# EAGLE design pic32 (EAGLE 9.3.0)
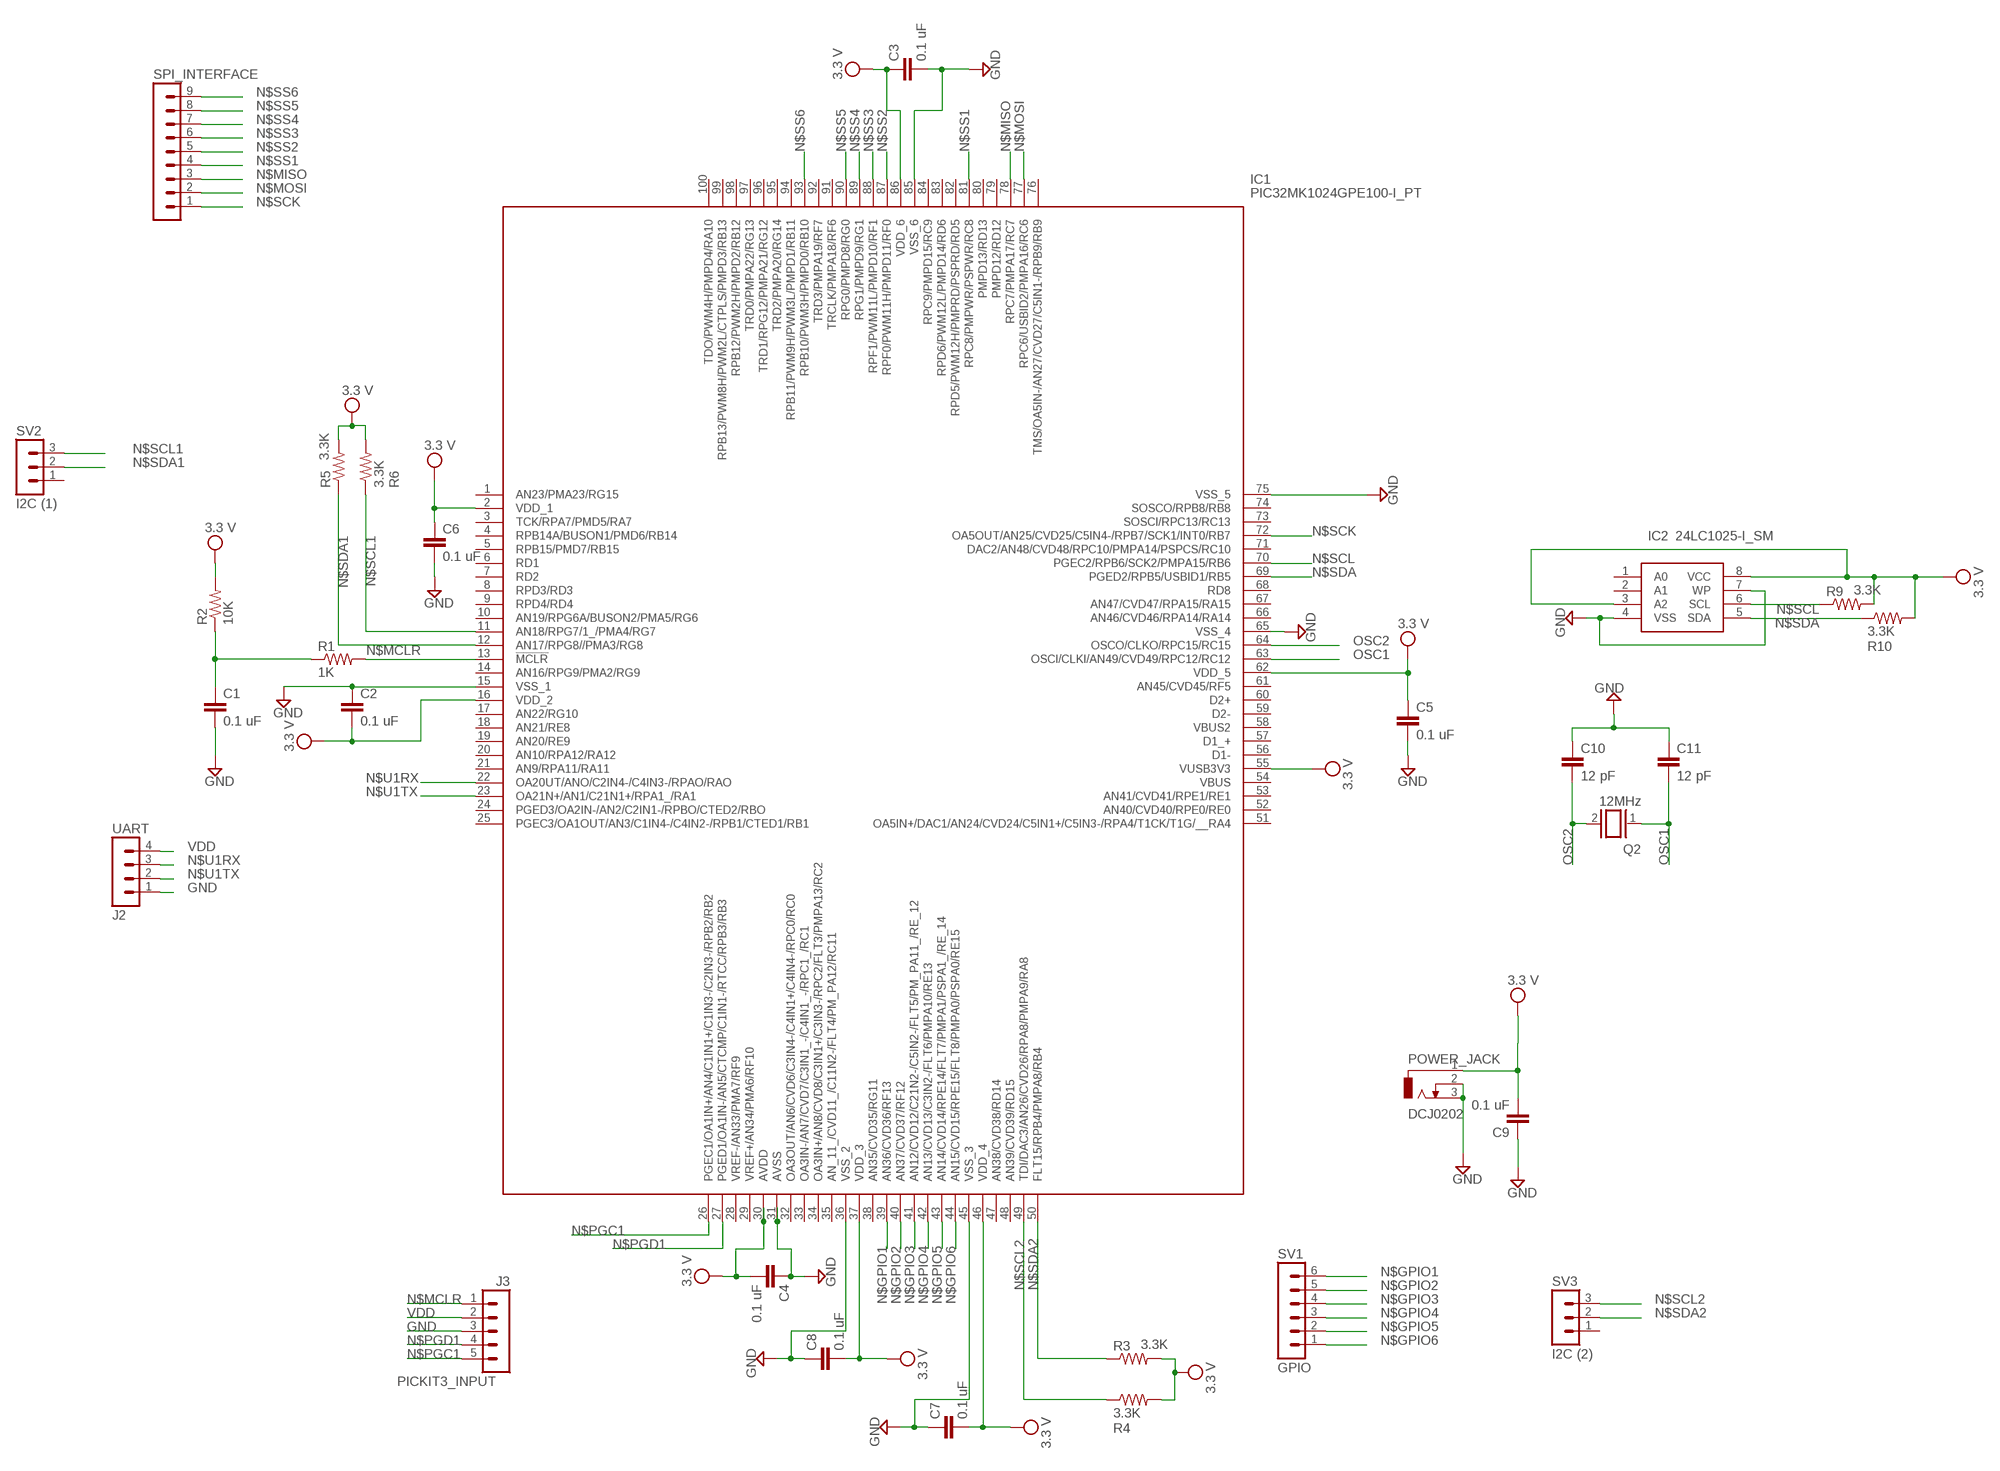
[diagram p0: schematic, sheet 1]

## Parts
C1  0.1 uF  C-EU025-025X050  [C025-025X050]
C2  0.1 uF  C-EU025-025X050  [C025-025X050]
C3  0.1 uF  C-EU025-025X050  [C025-025X050]
C4  0.1 uF  C-EU025-025X050  [C025-025X050]
C5  0.1 uF  C-EU025-025X050  [C025-025X050]
C6  0.1 uF  C-EU025-025X050  [C025-025X050]
C7  0.1 uF  C-EU025-025X050  [C025-025X050]
C8  0.1 uF  C-EU025-025X050  [C025-025X050]
C9  0.1 uF  C-EU025-025X050  [C025-025X050]
C10  12 pF  C-EU025-025X050  [C025-025X050]
C11  12 pF  C-EU025-025X050  [C025-025X050]
IC1  PIC32MK1024GPE100-I_PT  [QFP40P1400X1400X120-100N]
IC2  24LC1025-I_SM  [SOIC127P794X203-8N]
PICKIT3_INPUT  J3  MA05-1  [MA05-1]
POWER_JACK  DCJ0202  [DCJ0202]
Q2  12MHz  XTAL/S  [QS]
R1  1K  R-US_0207/7  [0207/7]
R2  10K  R-US_0207/7  [0207/7]
R3  3.3K  R-US_0207/7  [0207/7]
R4  3.3K  R-US_0207/7  [0207/7]
R5  3.3K  R-US_0207/7  [0207/7]
R6  3.3K  R-US_0207/7  [0207/7]
R9  3.3K  R-US_0207/7  [0207/7]
R10  3.3K  R-US_0207/7  [0207/7]
SPI_INTERFACE  J1  MA09-1  [MA09-1]
SV1  GPIO  MA06-1  [MA06-1]
SV2  I2C (1)  MA03-1  [MA03-1]
SV3  I2C (2)  MA03-1  [MA03-1]
UART  J2  MA04-1  [MA04-1]

## Nets
GND: C1.2 C2.1 C3.2 C4.1 C5.2 C6.2 C7.1 C8.1 C9.1 C10.1 C11.1 IC1.15(VSS_1) IC1.31(AVSS) IC1.36(VSS_2) IC1.45(VSS_3) IC1.65(VSS_4) IC1.75(VSS_5) IC1.85(VSS_6) IC2.4(VSS) IC2.7(WP) PICKIT3_INPUT.3 POWER_JACK.2 POWER_JACK.3 UART.1
N$1: C1.1 R1.1 R2.1
N$GPIO1: IC1.39(AN36/CVD36/RF13) SV1.6
N$GPIO2: IC1.40(AN37/CVD37/RF12) SV1.5
N$GPIO3: IC1.41(AN12/CVD12/C21N2-/C5IN2-/FLT5/PM_PA11_/RE_12) SV1.4
N$GPIO4: IC1.42(AN13/CVD13/C3IN2-/FLT6/PMPA10/RE13) SV1.3
N$GPIO5: IC1.43(AN14/CVD14/RPE14/FLT7/PMPA1/PSPA1_/RE_14) SV1.2
N$GPIO6: IC1.44(AN15/CVD15/RPE15/FLT8/PMPA0/PSPA0/RE15) SV1.1
N$MCLR: IC1.13(!MCLR) PICKIT3_INPUT.1 R1.2
N$MISO: IC1.78(RPC7/PMPA17/RC7) SPI_INTERFACE.3
N$MOSI: IC1.77(RPC6/USBID2/PMPA16/RC6) SPI_INTERFACE.2
N$PGC1: IC1.26(PGEC1/OA1IN+/AN4/C1IN1+/C1IN3-/C2IN3-/RPB2/RB2) PICKIT3_INPUT.5
N$PGD1: IC1.27(PGED1/OA1IN-/AN5/CTCMP/C1IN1-/RTCC/RPB3/RB3) PICKIT3_INPUT.4
N$SCK: IC1.72(OA5OUT/AN25/CVD25/C5IN4-/RPB7/SCK1/INT0/RB7) SPI_INTERFACE.1
N$SCL: IC1.70(PGEC2/RPB6/SCK2/PMPA15/RB6) IC2.6(SCL) R9.1
N$SCL1: IC1.11(AN18/RPG7/1_/PMA4/RG7) R6.1 SV2.3
N$SCL2: IC1.49(TDI/DAC3/AN26/CVD26/RPA8/PMPA9/RA8) R4.1 SV3.3
N$SDA: IC1.69(PGED2/RPB5/USBID1/RB5) IC2.5(SDA) R10.1
N$SDA1: IC1.12(AN17/RPG8//PMA3/RG8) R5.1 SV2.2
N$SDA2: IC1.50(FLT15/RPB4/PMPA8/RB4) R3.1 SV3.2
N$SS1: IC1.81(RPC8/PMPWR/PSPWR/RC8) SPI_INTERFACE.4
N$SS2: IC1.87(RPF0/PWM11H/PMPD11/RF0) SPI_INTERFACE.5
N$SS3: IC1.88(RPF1/PWM11L/PMPD10/RF1) SPI_INTERFACE.6
N$SS4: IC1.89(RPG1/PMPD9/RG1) SPI_INTERFACE.7
N$SS5: IC1.90(RPG0/PMPD8/RG0) SPI_INTERFACE.8
N$SS6: IC1.93(RPB10/PWM3H/PMPD0/RB10) SPI_INTERFACE.9
N$U1RX: IC1.22(OA20UT/ANO/C2IN4-/C4IN3-/RPAO/RAO) UART.3
N$U1TX: IC1.23(OA21N+/AN1/C21N1+/RPA1_/RA1) UART.2
OSC1: C11.2 IC1.63(OSCI/CLKI/AN49/CVD49/RPC12/RC12) Q2.1
OSC2: C10.2 IC1.64(OSCO/CLKO/RPC15/RC15) Q2.2
VDD: C2.2 C3.1 C4.2 C5.1 C6.1 C7.2 C8.2 C9.2 IC1.2(VDD_1) IC1.16(VDD_2) IC1.30(AVDD) IC1.37(VDD_3) IC1.46(VDD_4) IC1.55(VUSB3V3) IC1.62(VDD_5) IC1.86(VDD_6) IC2.3(A2) IC2.8(VCC) PICKIT3_INPUT.2 POWER_JACK.1 R2.2 R3.2 R4.2 R5.2 R6.2 R9.2 R10.2 UART.4 ; supply symbol labelled 3.3 V
Unconnected: IC1.1(AN23/PMA23/RG15) IC1.3(TCK/RPA7/PMD5/RA7) IC1.4(RPB14A/BUSON1/PMD6/RB14) IC1.5(RPB15/PMD7/RB15) IC1.6(RD1) IC1.7(RD2) IC1.8(RPD3/RD3) IC1.9(RPD4/RD4) IC1.10(AN19/RPG6A/BUSON2/PMA5/RG6) IC1.14(AN16/RPG9/PMA2/RG9) IC1.17(AN22/RG10) IC1.18(AN21/RE8) IC1.19(AN20/RE9) IC1.20(AN10/RPA12/RA12) IC1.21(AN9/RPA11/RA11) IC1.24(PGED3/OA2IN-/AN2/C2IN1-/RPBO/CTED2/RBO) IC1.25(PGEC3/OA1OUT/AN3/C1IN4-/C4IN2-/RPB1/CTED1/RB1) IC1.28(VREF-/AN33/PMA7/RF9) IC1.29(VREF+/AN34/PMA6/RF10) IC1.32(OA3OUT/AN6/CVD6/C3IN4-/C4IN1+/C4IN4-/RPC0/RC0) IC1.33(OA3IN-/AN7/CVD7/C3IN1_-/C4IN1_-/RPC1_/RC1) IC1.34(OA3IN+/AN8/CVD8/C3IN1+/C3IN3-/RPC2/FLT3/PMPA13/RC2) IC1.35(AN_11_/CVD11_/C11N2-/FLT4/PM_PA12/RC11) IC1.38(AN35/CVD35/RG11) IC1.47(AN38/CVD38/RD14) IC1.48(AN39/CVD39/RD15) IC1.51(OA5IN+/DAC1/AN24/CVD24/C5IN1+/C5IN3-/RPA4/T1CK/T1G/__RA4) IC1.52(AN40/CVD40/RPE0/RE0) IC1.53(AN41/CVD41/RPE1/RE1) IC1.54(VBUS) IC1.56(D1-) IC1.57(D1_+) IC1.58(VBUS2) IC1.59(D2-) IC1.60(D2+) IC1.61(AN45/CVD45/RF5) IC1.66(AN46/CVD46/RPA14/RA14) IC1.67(AN47/CVD47/RPA15/RA15) IC1.68(RD8) IC1.71(DAC2/AN48/CVD48/RPC10/PMPA14/PSPCS/RC10) IC1.73(SOSCI/RPC13/RC13) IC1.74(SOSCO/RPB8/RB8) IC1.76(TMS/OA5IN-/AN27/CVD27/C5IN1-/RPB9/RB9) IC1.79(PMPD12/RD12) IC1.80(PMPD13/RD13) IC1.82(RPD5/PWM12H/PMPRD/PSPRD/RD5) IC1.83(RPD6/PWM12L/PMPD14/RD6) IC1.84(RPC9/PMPD15/RC9) IC1.91(TRCLK/PMPA18/RF6) IC1.92(TRD3/PMPA19/RF7) IC1.94(RPB11/PWM9H/PWM3L/PMPD1/RB11) IC1.95(TRD2/PMPA20/RG14) IC1.96(TRD1/RPG12/PMPA21/RG12) IC1.97(TRD0/PMPA22/RG13) IC1.98(RPB12/PWM2H/PMPD2/RB12) IC1.99(RPB13/PWM8H/PWM2L/CTPLS/PMPD3/RB13) IC1.100(TDO/PWM4H/PMPD4/RA10) IC2.1(A0) IC2.2(A1) SV2.1 SV3.1

## Library data of the parts
C1-C11 = rcl:C-EU: CAPACITOR, European symbol; SPICEPREFIX: C
IC1 = SamacSys_Parts:PIC32MK1024GPE100-I_PT: 32-bit Microcontrollers - MCU MCU32, 120MHz, 4 I2C, 6 I2S, USB FS, CAN 2.0B, 12-bit ADC Source: Datasheet <https://componentsearchengine.com/Datasheets/1/PIC32MK1024GPE100-I_PT.pdf>; DESCRIPTION: 32-bit Microcontrollers - MCU MCU32, 120MHz, 4 I2C, 6 I2S, USB FS, CAN 2.0B, 12-bit ADC; HEIGHT: 1.2mm; MANUFACTURER_NAME: Microchip; MANUFACTURER_PART_NUMBER: PIC32MK1024GPE100-I/PT; MOUSER_PART_NUMBER: 579-2MK1024GPE100IPT; MOUSER_PRICE-STOCK: https://www.mouser.com/Search/Refine.aspx?Keyword=579-2MK1024GPE100IPT
IC2 = 24LC1025-I_SM:24LC1025-I_SM: 1M 128Kx8 2.5V Ser. EEPROM,24LC1025-I/SM Source: Datasheet <https://componentsearchengine.com/Datasheets/1/24LC1025-I_SM.pdf>; DESCRIPTION: 1M 128Kx8 2.5V Ser. EEPROM,24LC1025-I/SM; HEIGHT: 2.03mm; MANUFACTURER_NAME: Microchip; MANUFACTURER_PART_NUMBER: 24LC1025-I/SM; MOUSER_PART_NUMBER: 579-24LC1025-I/SM; MOUSER_PRICE-STOCK: https://www.mouser.com/Search/Refine.aspx?Keyword=579-24LC1025-I%2FSM
PICKIT3_INPUT = con-lstb:MA05-1: PIN HEADER; OC_FARNELL: unknown; OC_NEWARK: unknown
POWER_JACK = con-jack:DCJ0202: DC POWER JACK Source: DCJ0202.pdf; OC_FARNELL: unknown; OC_NEWARK: unknown
Q2 = special:XTAL/S: CRYSTAL
R1-R6 R9 R10 = rcl:R-US_: RESISTOR, American symbol; SPICEPREFIX: R
SPI_INTERFACE = con-lstb:MA09-1: PIN HEADER; OC_FARNELL: unknown; OC_NEWARK: unknown
SV1 = con-lstb:MA06-1: PIN HEADER; OC_FARNELL: unknown; OC_NEWARK: unknown
SV2 SV3 = con-lstb:MA03-1: PIN HEADER; OC_FARNELL: unknown; OC_NEWARK: unknown
UART = con-lstb:MA04-1: PIN HEADER; OC_FARNELL: unknown; OC_NEWARK: unknown

## Board
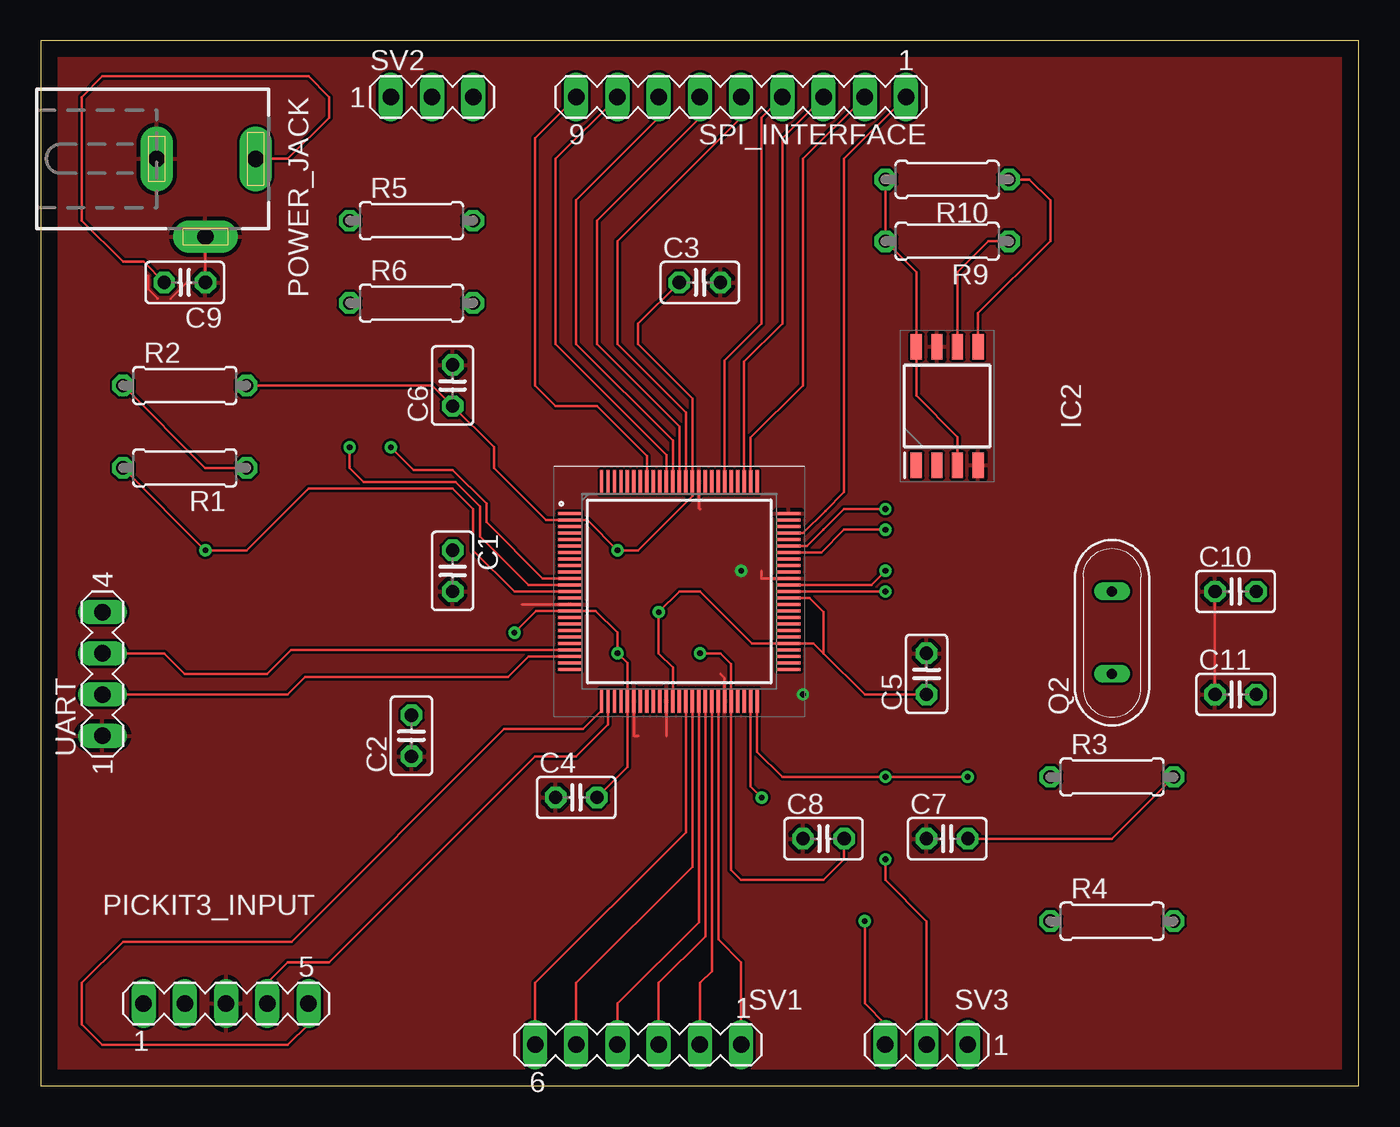
[diagram p1: board, top side]
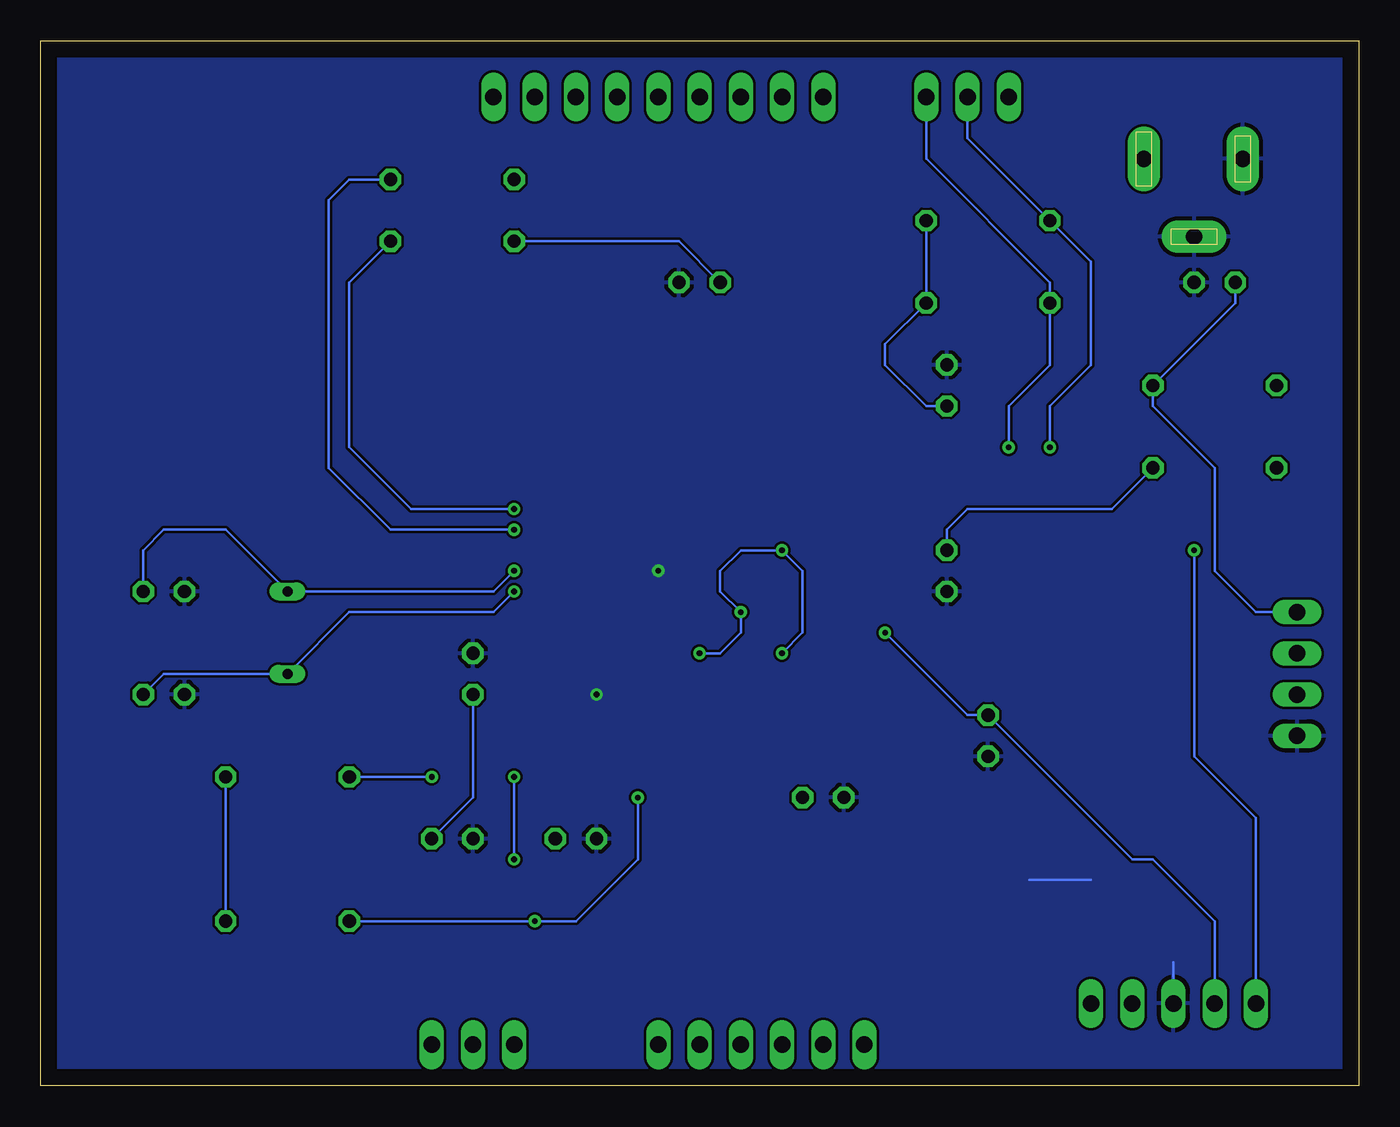
[diagram p2: board, bottom side, seen from below]

Size 81.26 x 64.44 mm. Coordinates in mm from the lower left corner, seen from the top.
Outline: 0,0 81.26,0 81.26,64.44 0,64.44 0,0
Copper layers (1*16): Top 0.035mm / dielectric 1.5mm / Bottom 0.035mm
Design rules "default": minimum track width 6mil, minimum drill 0.35mm, track to track 6mil, track to pad 6mil, pad to pad 6mil, via to via 6mil, smd to smd 6mil, copper to edge 40mil, drill to drill 6mil, minimum pad ring 10mil, minimum via ring 8mil, stop-mask expansion 4mil, vias tented up to drill 0mil, thermal gap 10mil

### Footprints (pad centres in the part's own frame; a part is rotated, then mirrored left to right if it is on the bottom)
C025-025X050 = drill 0.813 octagon: 1 -1.27,0; 2 1.27,0
QFP40P1400X1400X120-100N = smd 1.475 x 0.2: 1 -6.738,4.8; 2 -6.738,4.4; 3 -6.738,4; 4 -6.738,3.6; 5 -6.738,3.2; 6 -6.738,2.8; 7 -6.738,2.4; 8 -6.738,2; 9 -6.738,1.6; 10 -6.738,1.2; 11 -6.738,0.8; 12 -6.738,0.4; 13 -6.738,0; 14 -6.738,-0.4; 15 -6.738,-0.8; 16 -6.738,-1.2; 17 -6.738,-1.6; 18 -6.738,-2; 19 -6.738,-2.4; 20 -6.738,-2.8; 21 -6.738,-3.2; 22 -6.738,-3.6; 23 -6.738,-4; 24 -6.738,-4.4; 25 -6.738,-4.8; 51 6.738,-4.8; 52 6.738,-4.4; 53 6.738,-4; 54 6.738,-3.6; 55 6.738,-3.2; 56 6.738,-2.8; 57 6.738,-2.4; 58 6.738,-2; 59 6.738,-1.6; 60 6.738,-1.2; 61 6.738,-0.8; 62 6.738,-0.4; 63 6.738,0; 64 6.738,0.4; 65 6.738,0.8; 66 6.738,1.2; 67 6.738,1.6; 68 6.738,2; 69 6.738,2.4; 70 6.738,2.8; 71 6.738,3.2; 72 6.738,3.6; 73 6.738,4; 74 6.738,4.4; 75 6.738,4.8 | smd 0.2 x 1.475: 26 -4.8,-6.738; 27 -4.4,-6.738; 28 -4,-6.738; 29 -3.6,-6.738; 30 -3.2,-6.738; 31 -2.8,-6.738; 32 -2.4,-6.738; 33 -2,-6.738; 34 -1.6,-6.738; 35 -1.2,-6.738; 36 -0.8,-6.738; 37 -0.4,-6.738; 38 0,-6.738; 39 0.4,-6.738; 40 0.8,-6.738; 41 1.2,-6.738; 42 1.6,-6.738; 43 2,-6.738; 44 2.4,-6.738; 45 2.8,-6.738; 46 3.2,-6.738; 47 3.6,-6.738; 48 4,-6.738; 49 4.4,-6.738; 50 4.8,-6.738; 76 4.8,6.738; 77 4.4,6.738; 78 4,6.738; 79 3.6,6.738; 80 3.2,6.738; 81 2.8,6.738; 82 2.4,6.738; 83 2,6.738; 84 1.6,6.738; 85 1.2,6.738; 86 0.8,6.738; 87 0.4,6.738; 88 0,6.738; 89 -0.4,6.738; 90 -0.8,6.738; 91 -1.2,6.738; 92 -1.6,6.738; 93 -2,6.738; 94 -2.4,6.738; 95 -2.8,6.738; 96 -3.2,6.738; 97 -3.6,6.738; 98 -4,6.738; 99 -4.4,6.738; 100 -4.8,6.738
SOIC127P794X203-8N = smd 1.55 x 0.7: 1 -3.65,1.905; 2 -3.65,0.635; 3 -3.65,-0.635; 4 -3.65,-1.905; 5 3.65,-1.905; 6 3.65,-0.635; 7 3.65,0.635; 8 3.65,1.905
MA05-1 = drill 1.016 long: 1 -5.08,0; 2 -2.54,0; 3 0,0; 4 2.54,0; 5 5.08,0
DCJ0202 = drill 1 pad 2 long: 1 0,3.1; 2 4.8,0; 3 0,-3
QS = drill 0.61 long: 1 -2.54,0; 2 2.54,0
0207/7 = drill 0.813 octagon: 1 -3.81,0; 2 3.81,0
MA09-1 = drill 1.016 long: 1 -10.16,0; 2 -7.62,0; 3 -5.08,0; 4 -2.54,0; 5 0,0; 6 2.54,0; 7 5.08,0; 8 7.62,0; 9 10.16,0
MA06-1 = drill 1.016 long: 1 -6.35,0; 2 -3.81,0; 3 -1.27,0; 4 1.27,0; 5 3.81,0; 6 6.35,0
MA03-1 = drill 1.016 long: 1 -2.54,0; 2 0,0; 3 2.54,0
MA04-1 = drill 1.016 long: 1 -3.81,0; 2 -1.27,0; 3 1.27,0; 4 3.81,0

### Placement (x,y rotation side)
C1  25.4,31.75 270 top
C2  22.86,21.59 90 top
C3  40.64,49.53 0 top
C4  33.02,17.78 0 top
C5  54.61,25.4 90 top
C6  25.4,43.18 90 top
C7  55.88,15.24 0 top
C8  48.26,15.24 0 top
C9  8.89,49.53 180 top
C10  73.66,30.48 0 top
C11  73.66,24.13 0 top
IC1  39.37,30.48 0 top
IC2  55.88,41.91 90 top
PICKIT3_INPUT  11.43,5.08 0 top
POWER_JACK  10.16,57.15 270 top
Q2  66.04,27.94 90 top
R1  8.89,38.1 180 top
R2  8.89,43.18 0 top
R3  66.04,19.05 0 top
R4  66.04,10.16 0 top
R5  22.86,53.34 0 top
R6  22.86,48.26 0 top
R9  55.88,52.07 180 top
R10  55.88,55.88 180 top
SPI_INTERFACE  43.18,60.96 180 top
SV1  36.83,2.54 180 top
SV2  24.13,60.96 0 top
SV3  54.61,2.54 180 top
UART  3.81,25.4 90 top

### Tracks (layer width: path | path; a pad name or v marks a point on that pad's centre or on a via)
GND  (via drill 0.35)
  Top 0.152: 6.63,49.94 6.63,49.12 7.21,48.54 | 8.03,48.54 9.02,49.53 C9.1 POWER_JACK.2 | C10.1 C11.1 | IC1.85 40.57,35.63 40.64,35.56 | IC1.65 44.45,31.28 44.45,31.75 | IC1.36 38.57,21.59 | IC1.31 36.57,21.59 36.83,21.59 | IC1.15 29.68,29.68 | IC1.45 42.17,25.14 41.91,25.4
  Bottom 0.152: 20.32,12.7 16.51,12.7 | 11.43,7.62 PICKIT3_INPUT.3
  other vias: 46.99,24.13 43.18,31.75
  pour Bottom: -3.81,66.04 99.06,66.04 99.06,-1.27 -3.81,-1.27
  pour Top: -2.54,0 -2.54,64.77 86.36,64.77 86.36,-1.27 -2.54,-1.27
N$1
  Top 0.152: R2.1 10.16,38.1 R1.1
  Bottom 0.152: R1.1 15.24,35.56 24.13,35.56 25.4,34.29 C1.1
N$GPIO1
  Top 0.152: IC1.39 39.77,15.64 30.48,6.35 SV1.6
N$GPIO2
  Top 0.152: IC1.40 40.17,13.5 33.02,6.35 SV1.5
N$GPIO3
  Top 0.152: IC1.41 40.57,10.09 35.56,5.08 SV1.4
N$GPIO4
  Top 0.152: IC1.42 40.97,9.22 38.1,6.35 SV1.3
N$GPIO5
  Top 0.152: IC1.43 41.37,7.08 40.64,6.35 SV1.2
N$GPIO6
  Top 0.152: IC1.44 41.77,9.03 43.18,7.62 SV1.1
N$MCLR  (via drill 0.35)
  Top 0.152: R1.2 v10.16,33.02 12.7,33.02 16.51,36.83 25.4,36.83 26.67,35.56 26.67,33.02 29.21,30.48 IC1.13
  Bottom 0.152: PICKIT3_INPUT.1 6.35,16.51 10.16,20.32 v10.16,33.02
N$MISO
  Top 0.152: IC1.78 43.37,44.64 45.72,46.99 45.72,58.42 SPI_INTERFACE.3
N$MOSI
  Top 0.152: IC1.77 43.77,39.96 46.99,43.18 46.99,57.15 SPI_INTERFACE.2
N$PGC1
  Top 0.152: IC1.26 34.57,23.14 33.43,22 28.58,22 15.47,8.89 5.08,8.89 2.54,6.35 2.54,3.81 3.81,2.54 15.24,2.54 16.51,3.81 PICKIT3_INPUT.5
N$PGD1
  Top 0.152: IC1.27 34.97,22.27 33.02,20.32 30.48,20.32 17.78,7.62 15.24,7.62 13.97,6.35 PICKIT3_INPUT.4
N$SCK
  Top 0.152: IC1.72 46.99,34.08 48.37,35.45 49.53,36.62 49.53,57.15 SPI_INTERFACE.1
N$SCL  (via drill 0.35)
  Top 0.152: R9.1 58.42,52.07 56.52,50.16 IC2.6 | IC1.70 47.25,33.28 48.26,34.29 49.53,35.56 v52.07,35.56
  Bottom 0.152: v52.07,35.56 58.42,35.56 62.23,39.37 62.23,49.53 R9.1
N$SCL1  (via drill 0.35)
  Top 0.152: v21.59,39.37 22.98,37.98 25.4,37.98 27.48,35.9 27.48,34.75 30.95,31.28 IC1.11
  Bottom 0.152: v21.59,39.37 21.59,41.91 19.05,44.45 R6.1 19.05,49.53 26.67,57.15 SV2.3
N$SCL2  (via drill 0.35)
  Top 0.152: IC1.49 43.77,18.46 v44.45,17.78 | v50.8,10.16 50.8,5.08 52.07,3.81 SV3.3
  Bottom 0.152: v44.45,17.78 44.45,13.97 48.26,10.16 v50.8,10.16 R4.1
N$SDA  (via drill 0.35)
  Top 0.152: IC2.5 57.78,47.62 62.23,52.07 62.23,54.61 60.96,55.88 R10.1 | IC1.69 48.12,32.88 49.53,34.29 v52.07,34.29
  Bottom 0.152: v52.07,34.29 59.69,34.29 63.5,38.1 63.5,54.61 62.23,55.88 R10.1
N$SDA1  (via drill 0.35)
  Top 0.152: v19.05,39.37 19.05,38.1 19.91,37.24 25.57,37.24 27.08,35.73 27.08,33.88 30.08,30.88 IC1.12
  Bottom 0.152: v19.05,39.37 19.05,41.91 16.51,44.45 16.51,50.8 R5.1 24.13,58.42 SV2.2
N$SDA2  (via drill 0.35)
  Top 0.152: IC1.50 44.17,20.6 45.72,19.05 v52.07,19.05 v57.15,19.05 | SV3.2 54.61,10.16 52.07,12.7 v52.07,13.97
  Bottom 0.152: v57.15,19.05 R3.1 | v52.07,19.05 v52.07,13.97
N$SS1
  Top 0.152: IC1.81 42.17,44.71 44.45,46.99 44.45,59.69 SPI_INTERFACE.4
N$SS2
  Top 0.152: IC1.87 39.77,41.51 35.56,45.72 35.56,52.07 43.18,59.69 SPI_INTERFACE.5
N$SS3
  Top 0.152: IC1.88 39.37,40.64 34.29,45.72 34.29,53.34 40.64,59.69 SPI_INTERFACE.6
N$SS4
  Top 0.152: IC1.89 38.97,39.77 33.02,45.72 33.02,54.61 38.1,59.69 SPI_INTERFACE.7
N$SS5
  Top 0.152: IC1.90 38.57,38.9 31.75,45.72 31.75,57.15 SPI_INTERFACE.8
N$SS6
  Top 0.152: SPI_INTERFACE.9 30.48,58.42 30.48,43.18 31.75,41.91 34.29,41.91 37.37,38.83 IC1.93
N$U1RX
  Top 0.152: UART.3 7.62,26.67 8.89,25.4 13.97,25.4 15.45,26.88 IC1.22
N$U1TX
  Top 0.152: IC1.23 30.09,26.48 28.82,25.21 16.32,25.21 15.24,24.13 UART.2
OSC1  (via drill 0.35)
  Top 0.152: IC1.63 v52.07,30.48
  Bottom 0.152: C11.2 73.66,25.4 Q2.1 62.23,29.21 53.34,29.21 v52.07,30.48
OSC2  (via drill 0.35)
  Top 0.152: IC1.64 51.2,30.88 v52.07,31.75
  Bottom 0.152: C10.2 74.93,33.02 73.66,34.29 69.85,34.29 Q2.2 53.34,30.48 v52.07,31.75
VDD  (via drill 0.35)
  Top 0.152: R2.2 24.13,43.18 C6.1 27.94,39.37 27.94,38.1 31.16,34.88 IC1.2 33.7,34.88 v35.56,33.02 36.83,33.02 40.17,36.36 IC1.86 40.17,42.38 36.83,45.72 36.83,46.99 C3.1 | IC2.3 56.52,40 53.98,42.54 IC2.8 53.98,50.16 R9.2 R10.2 | C4.2 36.17,19.66 IC1.30 36.17,26.06 v35.56,26.67 35.56,27.94 34.22,29.28 IC1.16 30.55,29.28 v29.21,27.94 | C5.1 50.8,24.13 48.26,26.67 | 48.26,26.67 47.65,27.28 IC1.55 43.84,27.28 40.64,30.48 39.37,30.48 v38.1,29.21 38.1,26.67 38.97,25.8 IC1.37 | IC1.62 47.39,30.08 48.26,29.21 48.26,26.67 | POWER_JACK.1 15.24,57.15 17.78,59.69 17.78,60.96 16.51,62.23 3.81,62.23 2.54,60.96 2.54,53.34 5.08,50.8 6.35,50.8 C9.2 | C7.2 66.04,15.24 R3.2 | C8.2 49.53,13.97 48.26,12.7 43.18,12.7 42.57,13.31 IC1.46 42.57,26.01 41.91,26.67 v40.64,26.67
  Bottom 0.152: C9.2 7.62,48.26 R2.2 12.7,41.91 8.89,38.1 8.89,31.75 6.35,29.21 UART.4 | C7.2 54.61,17.78 C5.1 | PICKIT3_INPUT.2 8.89,10.16 12.7,13.97 13.97,13.97 C2.2 24.13,22.86 v29.21,27.94 | R9.2 41.91,52.07 C3.1 | v35.56,26.67 34.29,27.94 34.29,31.75 v35.56,33.02 38.1,33.02 39.37,31.75 39.37,30.48 v38.1,29.21 38.1,27.94 39.37,26.67 v40.64,26.67 | R5.2 R6.2 29.21,45.72 29.21,44.45 26.67,41.91 C6.1 | R3.2 R4.2